# EasyEDA Pro project SAM-2.eprj, schematic RelaySch
Board Name: Relay; Create Date: 2026-07-23; Page Name: P1; Project Name: SAM-2; Schematic Name: RelaySch; Update Date: 2026-08-12; Company: EasyEDA.com; Page Size: A4; Version: V1.0
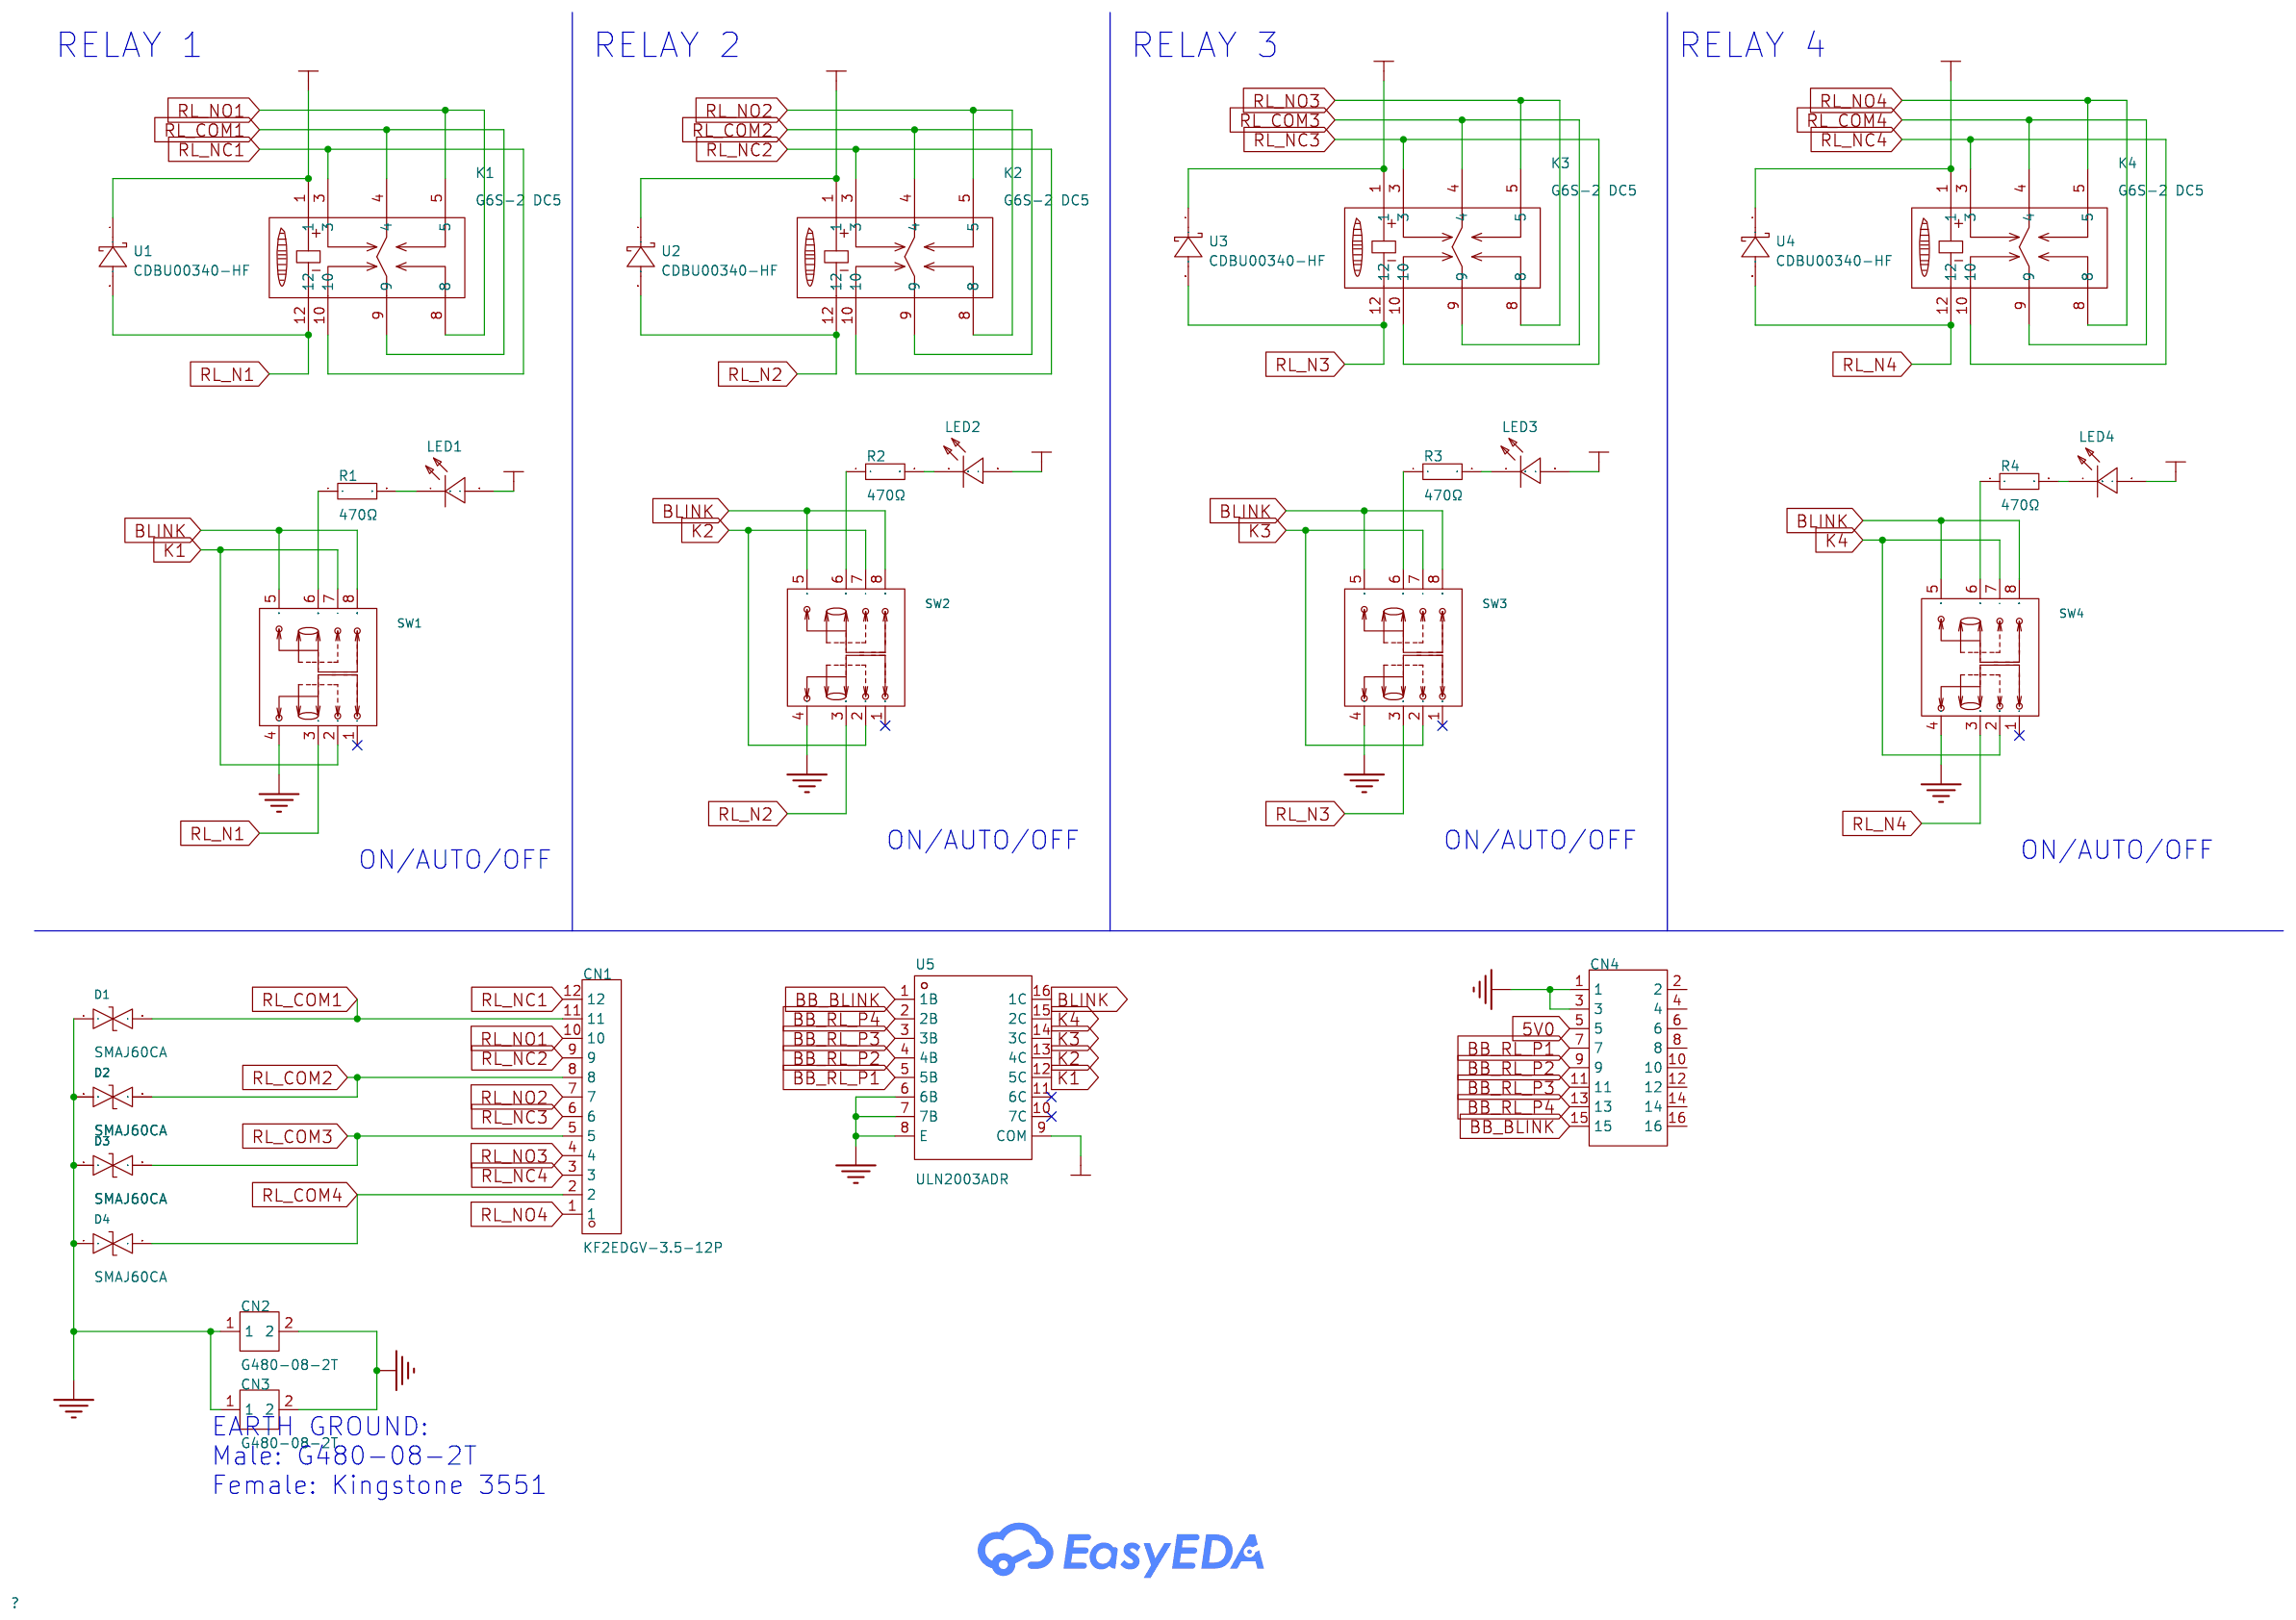
[diagram p17: schematic sheet]

## Parts
CN1  KF2EDGV-3.5-12P  [CONN-TH_12P-P3.50_KF2EDGV-3.5-12P]
CN2  G480-08-2T  [TH-2_L6.4-W0.8-P5.08]
CN3  G480-08-2T  [TH-2_L6.4-W0.8-P5.08]
CN4  PZ254V-12-16P  [HDR-TH_16P-P2.54-V-M-R2-C8-S2.54]
D1  SMAJ60CA  [SMA_L4.4-W2.6-LS5.0-BI]
D2  SMAJ60CA  [SMA_L4.4-W2.6-LS5.0-BI]
D3  SMAJ60CA  [SMA_L4.4-W2.6-LS5.0-BI]
D4  SMAJ60CA  [SMA_L4.4-W2.6-LS5.0-BI]
K1  G6S-2 DC5  [RELAY-TH_G6S-2-X]
K2  G6S-2 DC5  [RELAY-TH_G6S-2-X]
K3  G6S-2 DC5  [RELAY-TH_G6S-2-X]
K4  G6S-2 DC5  [RELAY-TH_G6S-2-X]
LED1  204-10SDRD/S530-A3/F182-68  [LED-TH_BD4.0-P2.50-RD]
LED2  204-10SDRD/S530-A3/F182-68  [LED-TH_BD4.0-P2.50-RD]
LED3  204-10SDRD/S530-A3/F182-68  [LED-TH_BD4.0-P2.50-RD]
LED4  204-10SDRD/S530-A3/F182-68  [LED-TH_BD4.0-P2.50-RD]
R1  470Ω  [R0402]
R2  470Ω  [R0402]
R3  470Ω  [R0402]
R4  470Ω  [R0402]
SW1  MSS23C02G2-KC 125  [SW-SMD_MSS23C02G2-KC]
SW2  MSS23C02G2-KC 125  [SW-SMD_MSS23C02G2-KC]
SW3  MSS23C02G2-KC 125  [SW-SMD_MSS23C02G2-KC]
SW4  MSS23C02G2-KC 125  [SW-SMD_MSS23C02G2-KC]
U1  CDBU00340-HF  [SOD-523F_L1.7-W0.9-LS1.7-RD]
U2  CDBU00340-HF  [SOD-523F_L1.7-W0.9-LS1.7-RD]
U3  CDBU00340-HF  [SOD-523F_L1.7-W0.9-LS1.7-RD]
U4  CDBU00340-HF  [SOD-523F_L1.7-W0.9-LS1.7-RD]
U5  ULN2003ADR  [SOIC-16_L9.9-W3.9-P1.27-LS6.0-BL]

## Library data of the parts
CN1 = KF2EDGV-3.5-12P: LCSC Part Name: 1x12P 3.5mm 排数:1 每排P数:12; Supplier Part: C441319; Manufacturer: KEFA(科发); Supplier Footprint: 插件,P=3.5mm; JLCPCB Part Class: Extended Part; Datasheet: https://item.szlcsc.com/datasheet/KF2EDGV-3.5-12P/441292.html; Supplier: LCSC; Connector Type: Board Side/Socket - Closed; Number of Positions or Pins: 1x12P; Pitch: 3.5mm; Color: Green; Mounting Type: Through Hole; Number of Pins: 12P; Number of Rows: 1; Number of PINs Per Row: 12; Current Rating: 10A; Voltage Rating (Max): 300V; Operating Temperature: -40℃~+105℃
CN2 CN3 = G480-08-2T: LCSC Part Name: PCB线路板焊接插片G4.8*W6.4*H11.8-0.8T黄铜两脚插件; Supplier Part: C39833011; Manufacturer: SAMZO(三佐); Supplier Footprint: 插件; JLCPCB Part Class: Extended Part; Datasheet: https://item.szlcsc.com/datasheet/G480-08-2T/41562156.html; Supplier: LCSC; Blade Width: 4.8mm; Number of Inserts: 1; Number of Leg: 2; Supplementary Features: Standard type; Rated Current: 10A; Body Material: Brass; Ontology Coating: Tin
CN4 = PZ254V-12-16P: LCSC Part Name: 2x8P 间距:2.54mm 方针 直插; Supplier Part: C492425; Manufacturer: XFCN(兴飞); Supplier Footprint: 插件,P=2.54mm; JLCPCB Part Class: Extended Part; Datasheet: https://item.szlcsc.com/datasheet/PZ254V-12-16P/502981.html; Supplier: LCSC; Pin Structure: 2x8P; Pitch: 2.54mm; Row Spacing: 2.54mm; Circluar Pins/Square Pins: Pin Header; Mounting Type: Through Hole; Number of Rows: 2; Number of Pins: 16P; Length of Mating Pin: 6mm; Insulation Height: 2.5mm; Length of End Connection Pin: 3mm; Contact Material: Brass; Operating Temperature: -40℃~+105℃; Color: Black
D1-D4 = SMAJ60CA_C151247: LCSC Part Name: 双向TVS; Supplier Part: C151247; Manufacturer: Littelfuse(美国力特); Supplier Footprint: SMA(DO-214AC); JLCPCB Part Class: Extended Part; Datasheet: https://item.szlcsc.com/datasheet/SMAJ60CA/162587.html; Supplier: LCSC; Polarity: Bidirectional; Reverse Stand-Off Voltage (Vrwm): 60V; Clamping Voltage: 96.8V; Peak Pulse Current (Ipp): 4.1A; Peak Pulse Power Dissipation (Ppp): 400W@10/1000us; Voltage - Breakdown: 73.7V; Reverse Leakage Current (Ir): 1uA; Operating Temperature: -65℃~+150℃; level of protection: IEC 61000-4-4；IEC 61000-4-2; Type: TVS
K1-K4 = G6S-2 DC5: LCSC Part Name: G6S-2-5V; Supplier Part: C32776; Manufacturer: OMRON(欧姆龙); Supplier Footprint: DIP,14.8x7.3mm; JLCPCB Part Class: Extended Part; Datasheet: https://item.szlcsc.com/datasheet/G6S-2%2520DC5/33741.html; Supplier: LCSC; Coil Voltage: 5V; Contact Form: 两组转换:2C(双刀双掷转换); Contact Rating: 500mA@125VAC；2A@30VDC; Switching Voltage(Max): 250V@AC；220V@DC; Contact Material: Silver + Gold Plated; Coil Rated Power: 140mW; Coil Resistance: 178Ω; Switching Current(Max): 2A; Operate Time: 4ms; Release Time: 4ms; Operating Temperature: -40℃~+85℃
LED1-LED4 = 204-10SDRD/S530-A3/F182-68: Supplier Part: C473831; Manufacturer: EVERLIGHT(亿光); Supplier Footprint: 插件; JLCPCB Part Class: Extended Part; Supplier: LCSC; Illumination Color: Red; Voltage - Forward(Vf): 2V; Power(Watts): 60mW; Wavelength - Dominant: 639nm; Peak Wavelength: 650nm; Diode Configuration: Discrete Diode; Lens Color: Frosted Red Lens; Luminous Intensity: 80mcd; Viewing Angle: 50°; Operating Temperature: -40℃~+85℃
R1-R4 = RC0402JR-07470RL: LCSC Part Name: 厚膜电阻 470Ω ±5% 62.5mW; Supplier Part: C114949; Manufacturer: YAGEO(国巨); Supplier Footprint: 0402; JLCPCB Part Class: Extended Part; Datasheet: https://atta.szlcsc.com/upload/public/pdf/source/20180821/C275644_0D56F95EFF785E7D9A1FEF436B37DA78.pdf; Supplier: LCSC; Type: Thick Film Resistors; Tolerance: ±5%; Temperature Coefficient: ±100ppm/℃; Operating Temperature Range: -55℃~+155℃
SW1-SW4 = MSS23C02G2-KC 125: Supplier Part: C2858292; Manufacturer: SHOU HAN(首韩); Supplier Footprint: SMD,9.9x3.6mm; JLCPCB Part Class: Extended Part; Datasheet: https://item.szlcsc.com/datasheet/MSS23C02G2-KC%2520125/3059442.html; Supplier: LCSC; Circuit: DP3T; Termination Style: SMD(SMT) Tab; Length: 9.9mm; Width: 3.55mm; Switch Height: 1.5mm; Mounting Type: Surface Mount,Vertical; Current Rating: 100mA; Voltage Rating: 12V; Life: 10000 times; Operating Temperature: -25℃~+70℃
U1-U4 = CDBU0130-HF: LCSC Part Name: 电压:30V 电流:100mA; Supplier Part: C2886021; Manufacturer: Comchip(典琦); Supplier Footprint: SOD-523F; JLCPCB Part Class: Extended Part; Datasheet: https://item.szlcsc.com/datasheet/CDBU0130-HF/3097060.html; Supplier: LCSC; Diode Configuration: Independent; Voltage - Forward(Vf@If): 440mV@100mA; Voltage - DC Reverse(Vr): 30V; Current - Rectified: 100mA; Reverse Leakage Current (Ir): 30uA@30V
U5 = ULN2003ADR: LCSC Part Name: 高压、大电流达林顿晶体管阵列; Supplier Part: C7512; Manufacturer: TI(德州仪器); Supplier Footprint: SOIC-16; JLCPCB Part Class: Basic Part; Datasheet: https://www.ti.com/cn/lit/gpn/uln2003a; Supplier: LCSC; number of channels: Seven channels; Collector - Emitter Voltage VCEO: 50V; Current - Collector(Ic): 500mA; Voltage - Input(Max): 30V; Output Leakage Current(Icex): 50uA; Voltage - Forward(Vf): 1.7V; Reverse Leakage Current (Ir): 50uA; Input Capacitiance(Ci): 15pF

## Nets
5V0: CN4.5 K1.1 K2.1 K3.1 K4.1 LED1.2(A) LED2.2(A) LED3.2(A) LED4.2(A) U1.1(K) U2.1(K) U3.1(K) U4.1(K) U5.9(COM)
BB_BLINK: CN4.15 U5.1(1B)
BB_RL_P1: CN4.7 U5.5(5B)
BB_RL_P2: CN4.9 U5.4(4B)
BB_RL_P3: CN4.11 U5.3(3B)
BB_RL_P4: CN4.13 U5.2(2B)
BLINK: SW1.5 SW1.8 SW2.5 SW2.8 SW3.5 SW3.8 SW4.5 SW4.8 U5.16(1C)
COM: CN4.1 CN4.3 SW1.4 SW2.4 SW3.4 SW4.4 U5.6(6B) U5.7(7B) U5.8(E)
EARTH_COM: CN2.1 CN2.2 CN3.1 CN3.2 D1.1(K) D2.1(K) D3.1(K) D4.1(K)
K1: SW1.2 SW1.7 U5.12(5C)
K2: SW2.2 SW2.7 U5.13(4C)
K3: SW3.2 SW3.7 U5.14(3C)
K4: SW4.2 SW4.7 U5.15(2C)
RL_COM1: CN1.11 D1.2(A) K1.4 K1.9
RL_COM2: CN1.8 D2.2(A) K2.4 K2.9
RL_COM3: CN1.5 D3.2(A) K3.4 K3.9
RL_COM4: CN1.2 D4.2(A) K4.4 K4.9
RL_N1: K1.12 SW1.3 U1.2(A)
RL_N2: K2.12 SW2.3 U2.2(A)
RL_N3: K3.12 SW3.3 U3.2(A)
RL_N4: K4.12 SW4.3 U4.2(A)
RL_NC1: CN1.12 K1.3 K1.10
RL_NC2: CN1.9 K2.3 K2.10
RL_NC3: CN1.6 K3.3 K3.10
RL_NC4: CN1.3 K4.3 K4.10
RL_NO1: CN1.10 K1.5 K1.8
RL_NO2: CN1.7 K2.5 K2.8
RL_NO3: CN1.4 K3.5 K3.8
RL_NO4: CN1.1 K4.5 K4.8
$1N2148: R1.1 SW1.6
$1N2154: LED1.1(C) R1.2
$1N6187: R2.1 SW2.6
$1N6188: LED2.1(C) R2.2
$1N6409: R3.1 SW3.6
$1N6410: LED3.1(C) R3.2
$1N6631: R4.1 SW4.6
$1N6632: LED4.1(C) R4.2

Not connected (* = marked no-connect by the designer): CN4 2 4 6 8 10 12 14 16; SW1 1*; SW2 1*; SW3 1*; SW4 1*; U5 10(7C)* 11(6C)*

## Notes on the sheet
- RELAY 1
- RELAY 2
- RELAY 3
- RELAY 4
- ON/AUTO/OFF
- ON/AUTO/OFF
- ON/AUTO/OFF
- ON/AUTO/OFF
- EARTH GROUND:
  Male: G480-08-2T
  Female: Kingstone 3551
